# EasyEDA schematic Photodiode plate.json
TITLE: Sheet_1; REV: 1.0; Date: 2024-04-13; Sheet: 1/1; Company: Your Company
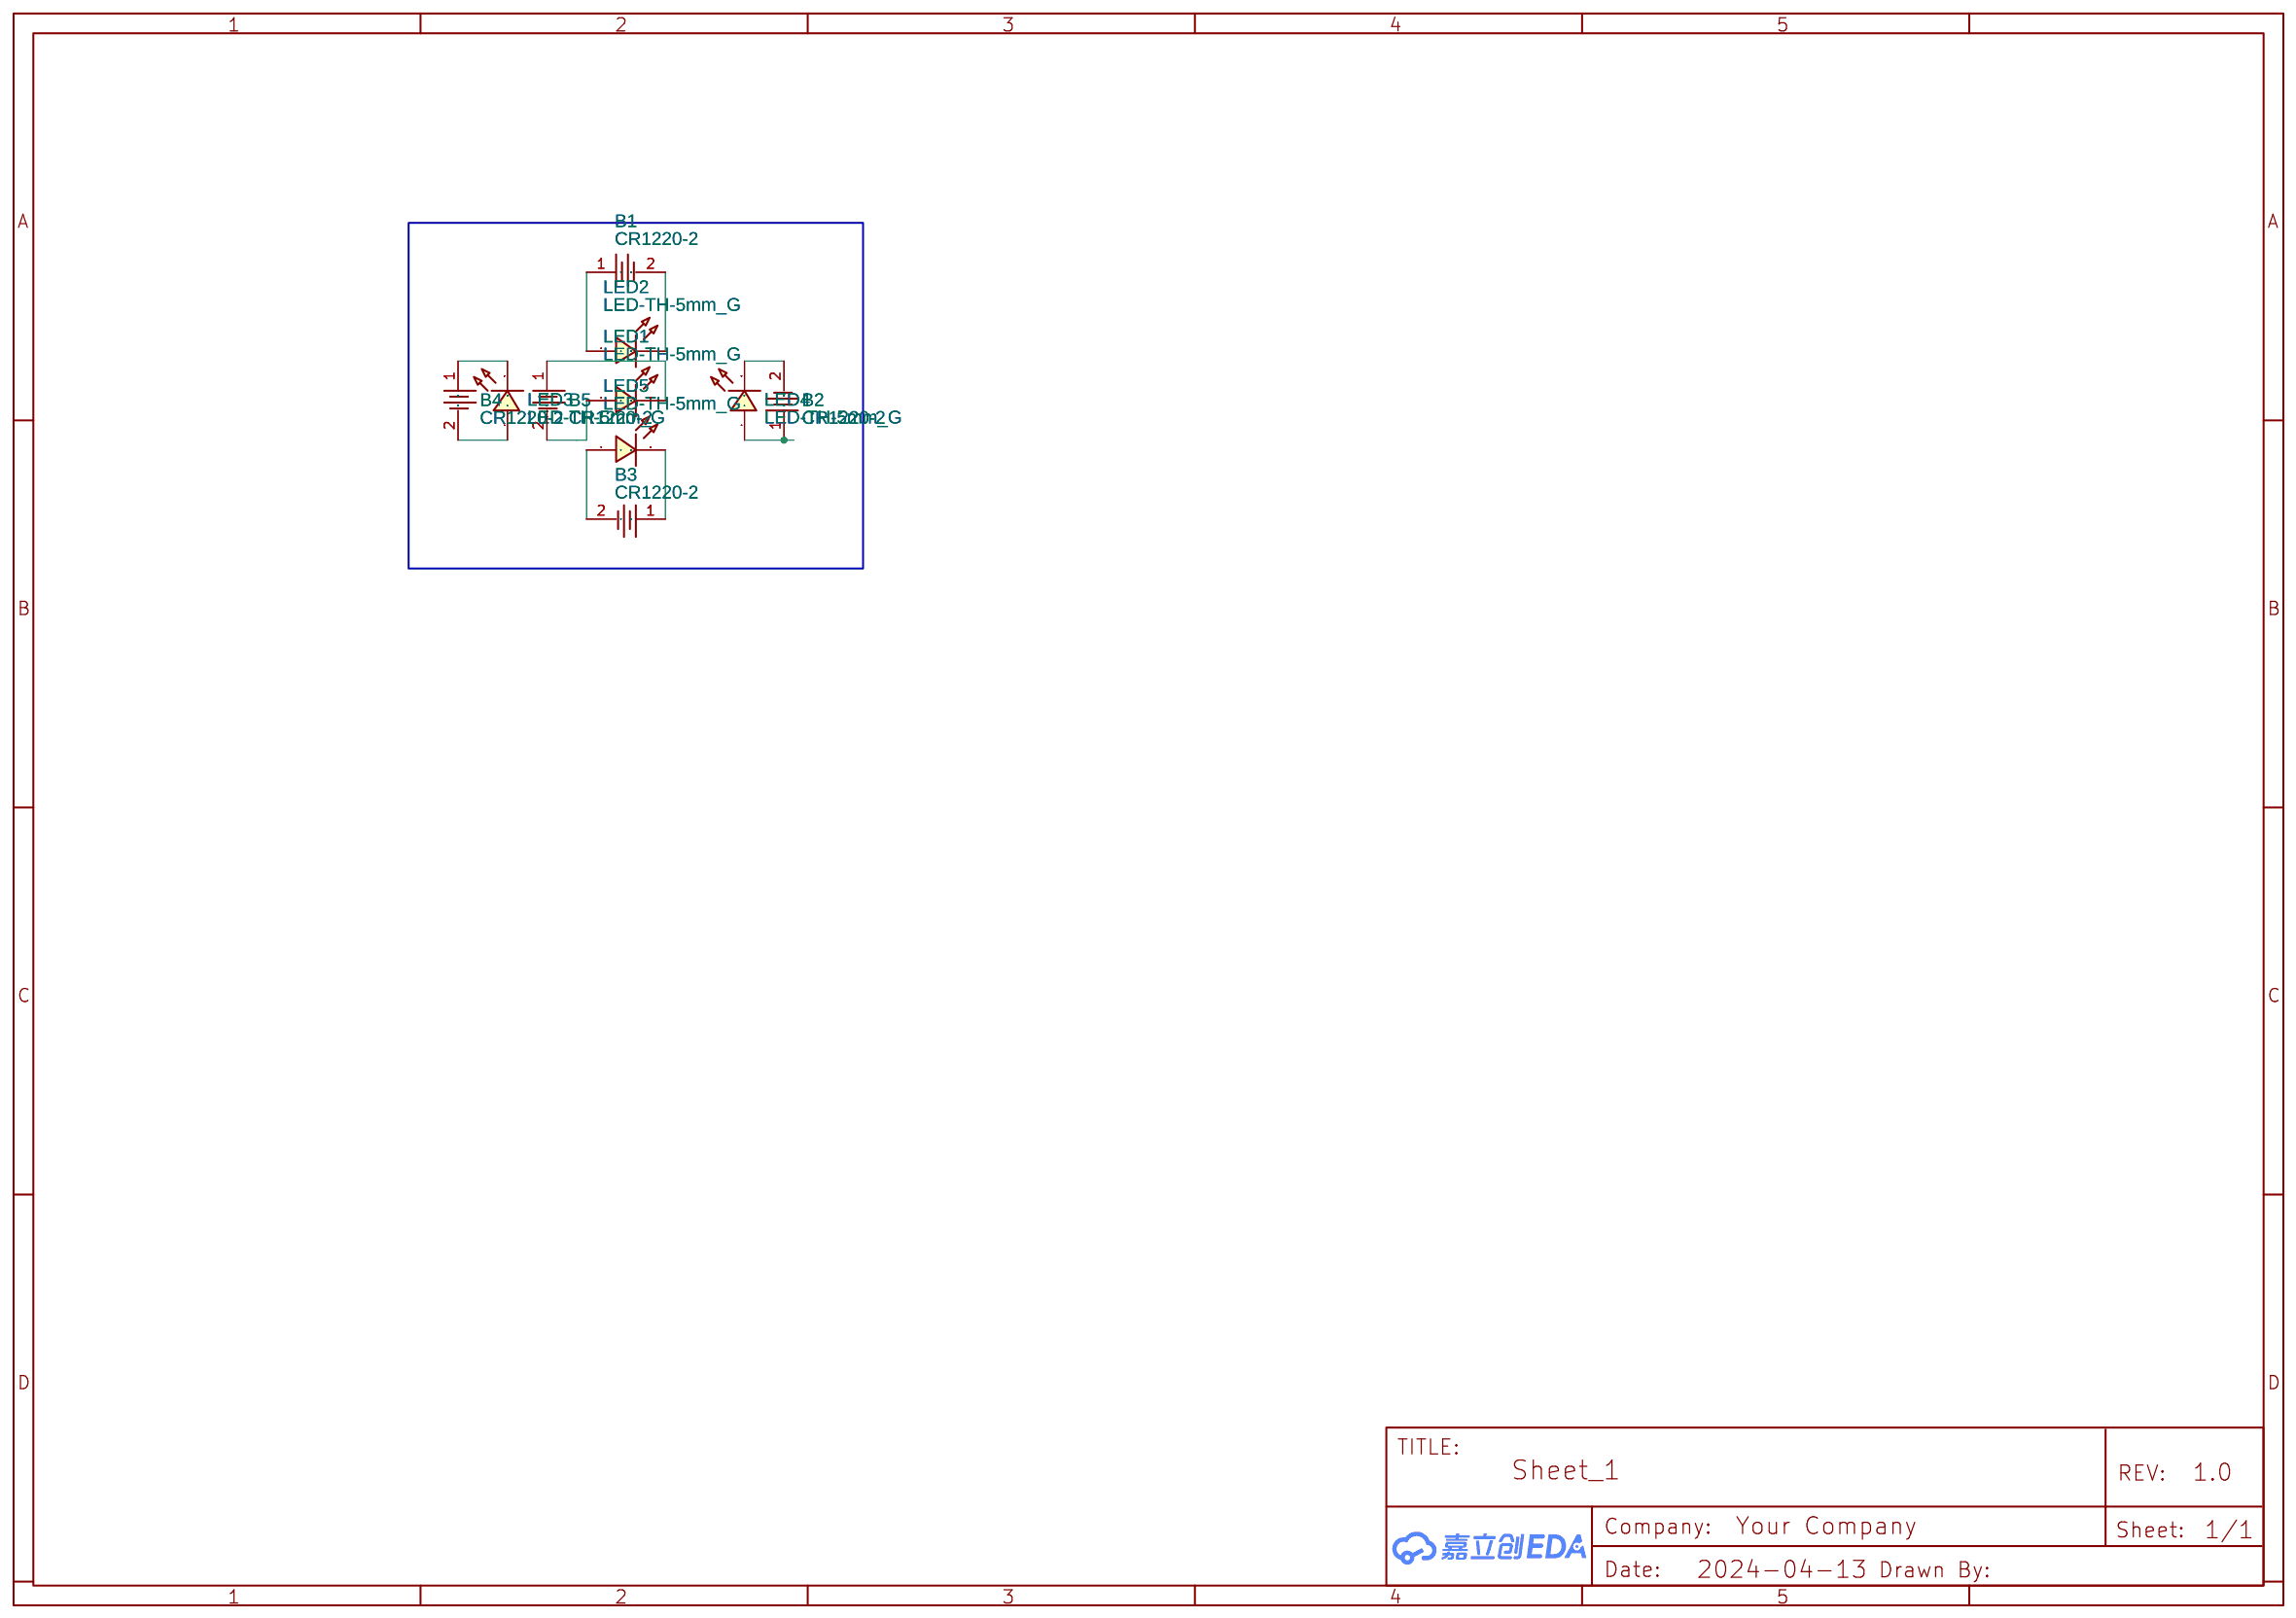
[diagram p0: schematic sheet]

## Parts
B1  CR1220-2  [BAT-SMD_CR1220-2]
B2  CR1220-2  [BAT-SMD_CR1220-2]
B3  CR1220-2  [BAT-SMD_CR1220-2]
B4  CR1220-2  [BAT-SMD_CR1220-2]
B5  CR1220-2  [BAT-SMD_CR1220-2]
LED1  LED-TH-5mm_G  [LED-TH_BD5.0_GREEN]
LED2  LED-TH-5mm_G  [LED-TH_BD5.0_GREEN]
LED3  LED-TH-5mm_G  [LED-TH_BD5.0_GREEN]
LED4  LED-TH-5mm_G  [LED-TH_BD5.0_GREEN]
LED5  LED-TH-5mm_G  [LED-TH_BD5.0_GREEN]

## Library data of the parts
B1-B5 = CR1220-2: Supplier: LCSC; Manufacturer: Q&J; image: //image.lceda.cn/szlcsc/C70381.jpg; Supplier Part: C70381
LED1-LED5 = LED-TH-5mm_G: Manufacturer: EVERLIGHT(台湾亿光); Manufacturer Part: 333-2SYGD/S530-E2; Supplier Part: C88163; Supplier: LCSC; Contributor: LCEDA_Lib

## Nets
Net-(B1-1): B1.1 LED2.1
Net-(B1-2): B1.2 LED2.2
Net-(B2-1): B2.1 LED4.1
Net-(B2-2): B2.2 LED4.2
Net-(B3-1): B3.1 LED5.2
Net-(B3-2): B3.2 LED5.1
Net-(B4-1): B4.1 LED3.2
Net-(B4-2): B4.2 LED3.1
Net-(B5-1): B5.1 LED1.2
Net-(B5-2): B5.2 LED1.1
